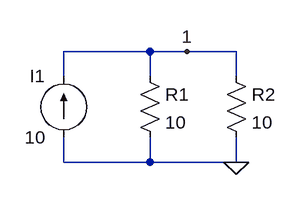
[diagram p0: schematic q1_circuit_2.asc]
q1_circuit_2.asc, the LTspice schematic file:
Version 4
SHEET 1 880 680
WIRE -144 80 -256 80
WIRE -96 80 -144 80
WIRE -32 80 -96 80
WIRE -256 112 -256 80
WIRE -144 112 -144 80
WIRE -32 112 -32 80
WIRE -256 224 -256 192
WIRE -144 224 -144 192
WIRE -144 224 -256 224
WIRE -32 224 -32 192
WIRE -32 224 -144 224
FLAG -32 224 0
FLAG -96 80 1
SYMBOL current -256 192 R180
WINDOW 0 24 80 Left 2
WINDOW 3 24 0 Left 2
SYMATTR InstName I1
SYMATTR Value 10
SYMBOL res -160 96 R0
SYMATTR InstName R1
SYMATTR Value 10
SYMBOL res -48 96 R0
SYMATTR InstName R2
SYMATTR Value 10

The netlist it stands for:
* q1_circuit_2.asc
I1 0 1 10
R1 1 0 10
R2 1 0 10
.backanno
.end